# Altium schematic sheet Pallette v0.5.SchDoc
size A3
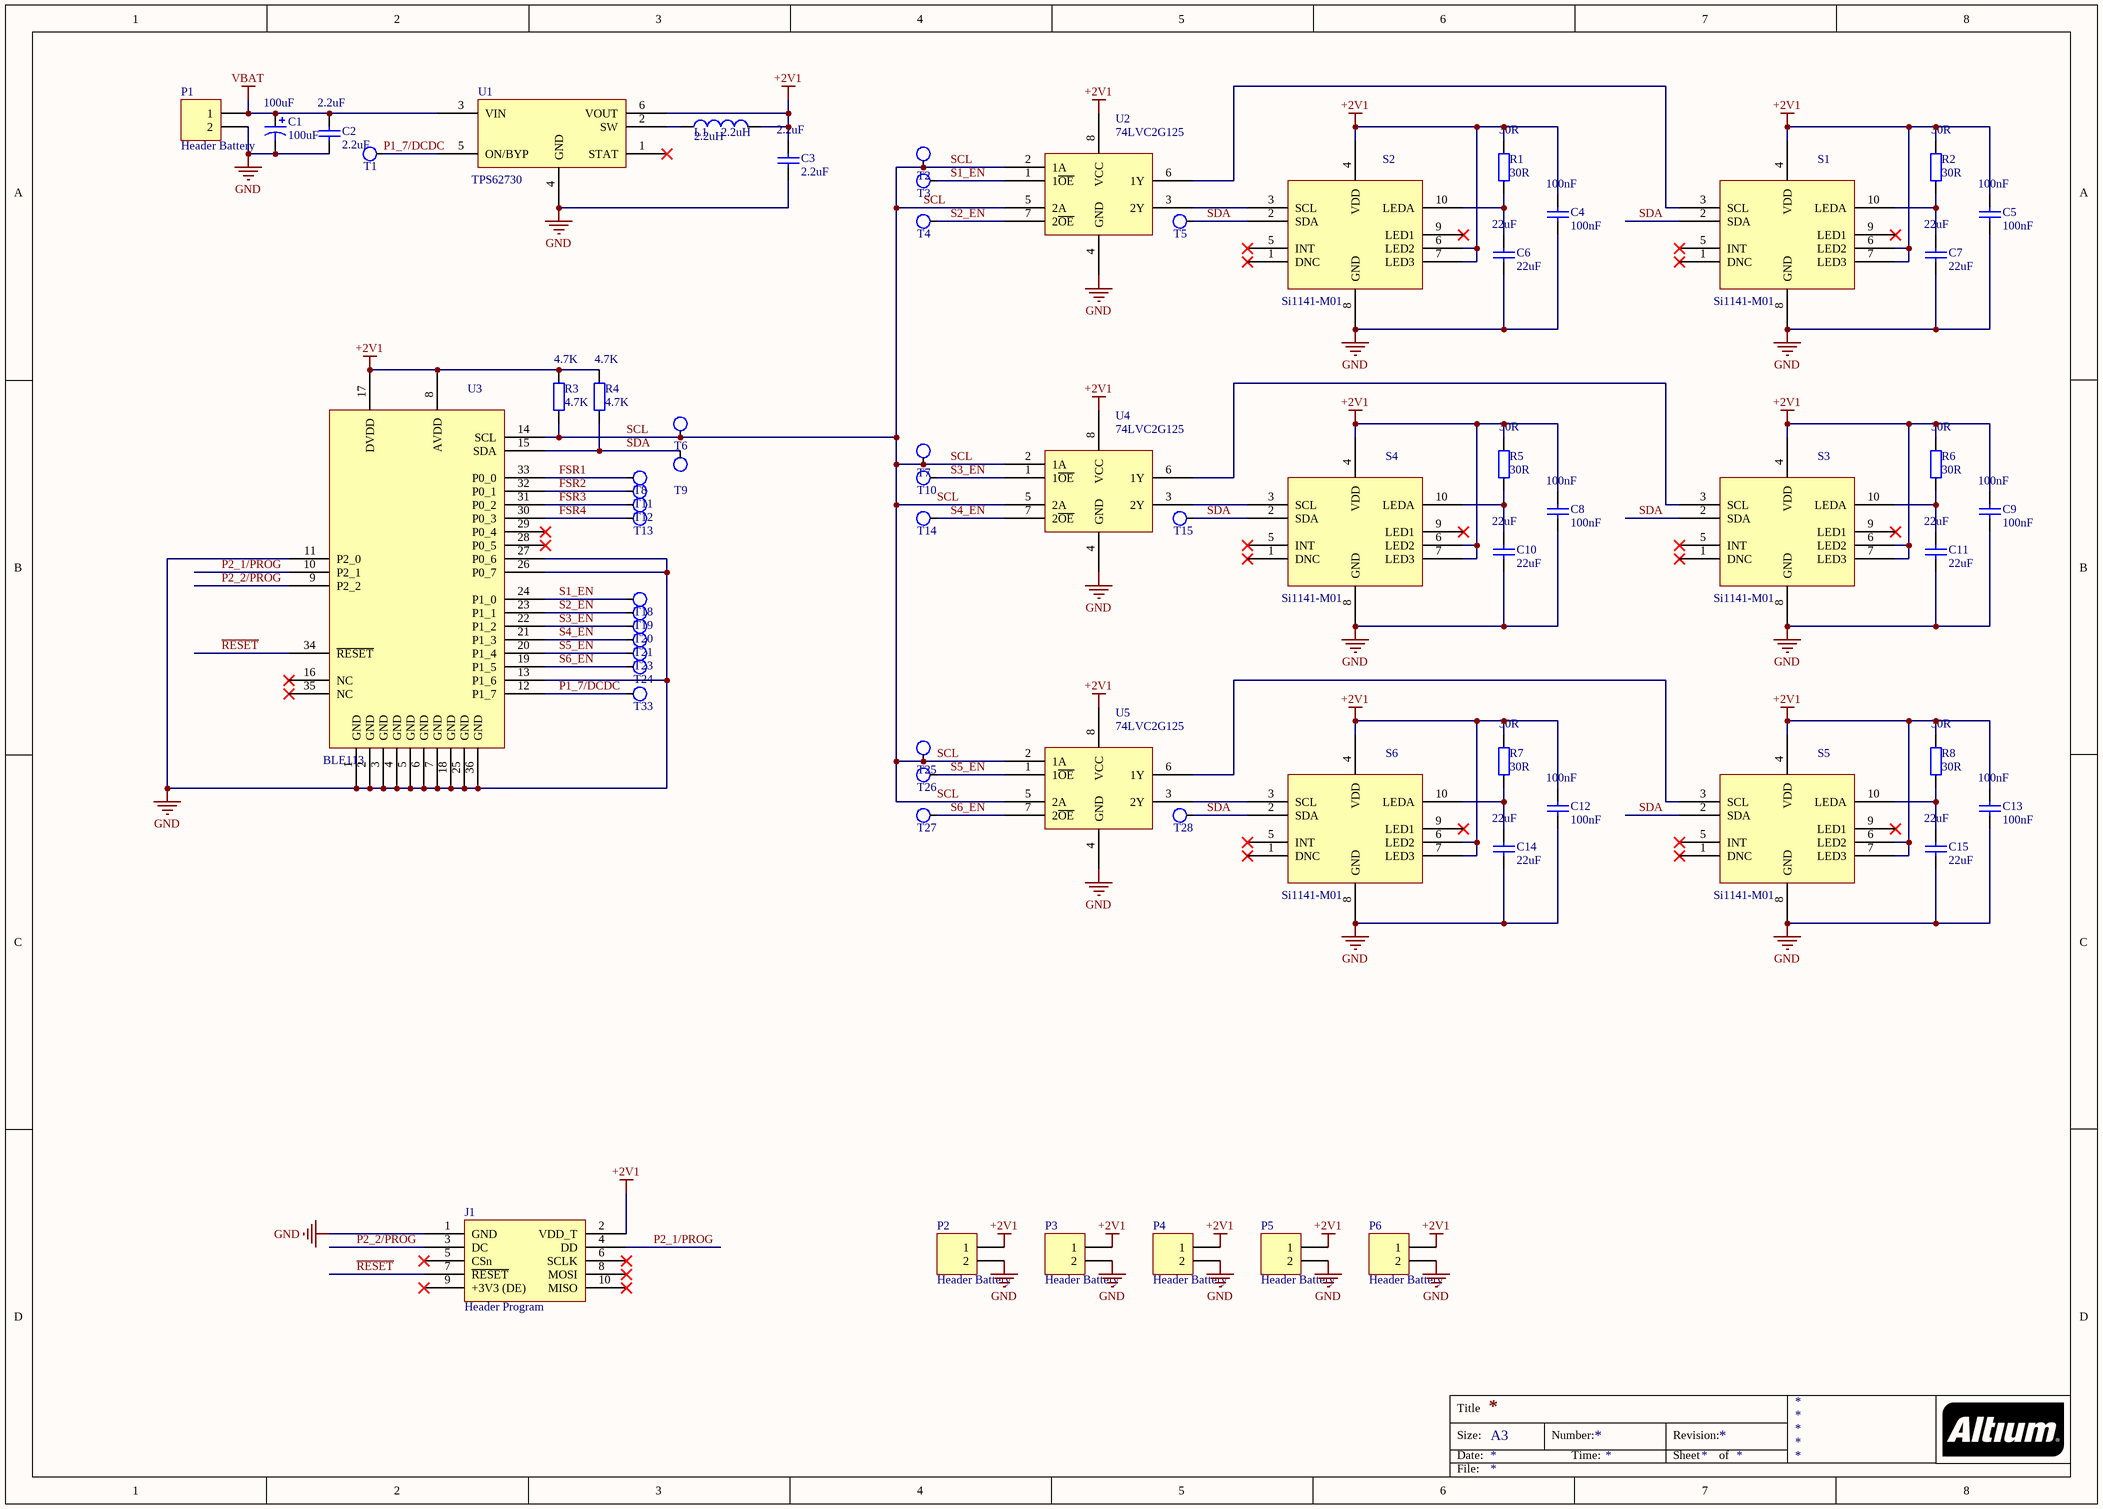
[diagram p0: Pallette v0.5.SchDoc]

## Parts
C1  100uF  [1411]
C2  2.2uF  [0402]
C3  2.2uF  [0402]
C4  100nF  [0402]
C5  100nF  [0402]
C6  22uF  [0603]
C7  22uF  [0603]
C8  100nF  [0402]
C9  100nF  [0402]
C10  22uF  [0603]
C11  22uF  [0603]
C12  100nF  [0402]
C13  100nF  [0402]
C14  22uF  [0603]
C15  22uF  [0603]
J1  Header Program  [TC2050-IDC-NL]  (no BOM)
L1  2.2uH  [0805]
P1  Header Battery  [Battery Leads]  (no BOM)
P2  Header Battery  [Battery Leads]  (no BOM)
P3  Header Battery  [Battery Leads]  (no BOM)
P4  Header Battery  [Battery Leads]  (no BOM)
P5  Header Battery  [Battery Leads]  (no BOM)
P6  Header Battery  [Battery Leads]  (no BOM)
R1  30R  [0402]
R2  30R  [0402]
R3  4.7K  [0402]
R4  4.7K  [0402]
R5  30R  [0402]
R6  30R  [0402]
R7  30R  [0402]
R8  30R  [0402]
S1  Si1141-M01  [SI1141-M01]
S2  Si1141-M01  [SI1141-M01]
S3  Si1141-M01  [SI1141-M01]
S4  Si1141-M01  [SI1141-M01]
S5  Si1141-M01  [SI1141-M01]
S6  Si1141-M01  [SI1141-M01]
T1  TP 1.2X2MM  [TP 1.2x2MM]  (value not drawn)  (no BOM)
T2  TP 1.2X2MM  [TP 1.2x2MM]  (value not drawn)  (no BOM)
T3  TP 1.2X2MM  [TP 1.2x2MM]  (value not drawn)  (no BOM)
T4  TP 1.2X2MM  [TP 1.2x2MM]  (value not drawn)  (no BOM)
T5  TP 1.2X2MM  [TP 1.2x2MM]  (value not drawn)  (no BOM)
T6  TP 1.2X2MM  [TP 1.2x2MM]  (value not drawn)  (no BOM)
T7  TP 1.2X2MM  [TP 1.2x2MM]  (value not drawn)  (no BOM)
T8  TP 1.2X2MM  [TP 1.2x2MM]  (value not drawn)  (no BOM)
T9  TP 1.2X2MM  [TP 1.2x2MM]  (value not drawn)  (no BOM)
T10  TP 1.2X2MM  [TP 1.2x2MM]  (value not drawn)  (no BOM)
T11  TP 1.2X2MM  [TP 1.2x2MM]  (value not drawn)  (no BOM)
T12  TP 1.2X2MM  [TP 1.2x2MM]  (value not drawn)  (no BOM)
T13  TP 1.2X2MM  [TP 1.2x2MM]  (value not drawn)  (no BOM)
T14  TP 1.2X2MM  [TP 1.2x2MM]  (value not drawn)  (no BOM)
T15  TP 1.2X2MM  [TP 1.2x2MM]  (value not drawn)  (no BOM)
T18  TP 1.2X2MM  [TP 1.2x2MM]  (value not drawn)  (no BOM)
T19  TP 1.2X2MM  [TP 1.2x2MM]  (value not drawn)  (no BOM)
T20  TP 1.2X2MM  [TP 1.2x2MM]  (value not drawn)  (no BOM)
T21  TP 1.2X2MM  [TP 1.2x2MM]  (value not drawn)  (no BOM)
T23  TP 1.2X2MM  [TP 1.2x2MM]  (value not drawn)  (no BOM)
T24  TP 1.2X2MM  [TP 1.2x2MM]  (value not drawn)  (no BOM)
T25  TP 1.2X2MM  [TP 1.2x2MM]  (value not drawn)  (no BOM)
T26  TP 1.2X2MM  [TP 1.2x2MM]  (value not drawn)  (no BOM)
T27  TP 1.2X2MM  [TP 1.2x2MM]  (value not drawn)  (no BOM)
T28  TP 1.2X2MM  [TP 1.2x2MM]  (value not drawn)  (no BOM)
T33  TP 1.2X2MM  [TP 1.2x2MM]  (value not drawn)  (no BOM)
U1  TPS62730  [6-UFDFN]
U2  74LVC2G125  [VSSOP8]
U3  BLE113  [BLE113-A]
U4  74LVC2G125  [VSSOP8]
U5  74LVC2G125  [VSSOP8]

## Nets
+2V1: C3.2 C4.2 C5.2 C8.2 C9.2 C12.2 C13.2 J1.2(VDD_T) L1.2 P2.1 P3.1 P4.1 P5.1 P6.1 R1.2 R2.2 R3.2 R4.2 R5.2 R6.2 R7.2 R8.2 S1.4(VDD) S1.6(LED2) S1.7(LED3) S2.4(VDD) S2.6(LED2) S2.7(LED3) S3.4(VDD) S3.6(LED2) S3.7(LED3) S4.4(VDD) S4.6(LED2) S4.7(LED3) S5.4(VDD) S5.6(LED2) S5.7(LED3) S6.4(VDD) S6.6(LED2) S6.7(LED3) U1.6(VOUT) U2.8(VCC) U3.8(AVDD) U3.17(DVDD) U4.8(VCC) U5.8(VCC)
GND: C1.2 C2.1 C3.1 C4.1 C5.1 C6.1 C7.1 C8.1 C9.1 C10.1 C11.1 C12.1 C13.1 C14.1 C15.1 J1.1(GND) P1.2 P2.2 P3.2 P4.2 P5.2 P6.2 S1.8(GND) S2.8(GND) S3.8(GND) S4.8(GND) S5.8(GND) S6.8(GND) U1.4(GND) U2.4(GND) U3.1(GND) U3.2(GND) U3.3(GND) U3.4(GND) U3.5(GND) U3.6(GND) U3.7(GND) U3.11(P2_0) U3.13(P1_6) U3.18(GND) U3.25(GND) U3.26(P0_7) U3.27(P0_6) U3.36(GND) U4.4(GND) U5.4(GND)
VBAT: C1.1 C2.2 P1.1 U1.3(VIN)
FSR1: T8.1 U3.33(P0_0)
FSR2: T11.1 U3.32(P0_1)
FSR3: T12.1 U3.31(P0_2)
FSR4: T13.1 U3.30(P0_3)
P1_7/DCDC: T1.1 T33.1 U1.5(ON/BYP) U3.12(P1_7)
P2_1/PROG: J1.4(DD) U3.10(P2_1)
P2_2/PROG: J1.3(DC) U3.9(P2_2)
~{RESET}: J1.7(~{RESET}) U3.34(~{RESET})
S1_EN: T3.1 T18.1 U2.1(1~{OE}) U3.24(P1_0)
S2_EN: T4.1 T19.1 U2.7(2~{OE}) U3.23(P1_1)
S3_EN: T10.1 T20.1 U3.22(P1_2) U4.1(1~{OE})
S4_EN: T14.1 T21.1 U3.21(P1_3) U4.7(2~{OE})
S5_EN: T23.1 T26.1 U3.20(P1_4) U5.1(1~{OE})
S6_EN: T24.1 T27.1 U3.19(P1_5) U5.7(2~{OE})
SCL: R3.1 T2.1 T6.1 T7.1 T25.1 U2.2(1A) U2.5(2A) U3.14(SCL) U4.2(1A) U4.5(2A) U5.2(1A) U5.5(2A)
SDA: R4.1 S1.2(SDA) S2.2(SDA) S3.2(SDA) S4.2(SDA) S5.2(SDA) S6.2(SDA) T5.1 T9.1 T15.1 T28.1 U3.15(SDA)
NetC6_2: C6.2 R1.1 S2.10(LEDA)
NetC7_2: C7.2 R2.1 S1.10(LEDA)
NetC10_2: C10.2 R5.1 S4.10(LEDA)
NetC11_2: C11.2 R6.1 S3.10(LEDA)
NetC14_2: C14.2 R7.1 S6.10(LEDA)
NetC15_2: C15.2 R8.1 S5.10(LEDA)
NetL1_1: L1.1 U1.2(SW)
NetS1_3: S1.3(SCL) U2.6(1Y)
NetS2_3: S2.3(SCL) U2.3(2Y)
NetS3_3: S3.3(SCL) U4.6(1Y)
NetS4_3: S4.3(SCL) U4.3(2Y)
NetS5_3: S5.3(SCL) U5.6(1Y)
NetS6_3: S6.3(SCL) U5.3(2Y)

Not connected (* = marked no-connect by the designer): J1 5(CSn)* 6(SCLK)* 8(MOSI)* 9(+3V3_(DE))* 10(MISO)*; S1 1(DNC)* 5(INT)* 9(LED1)*; S2 1(DNC)* 5(INT)* 9(LED1)*; S3 1(DNC)* 5(INT)* 9(LED1)*; S4 1(DNC)* 5(INT)* 9(LED1)*; S5 1(DNC)* 5(INT)* 9(LED1)*; S6 1(DNC)* 5(INT)* 9(LED1)*; U1 1(STAT)*; U3 16(NC)* 28(P0_5)* 29(P0_4)* 35(NC)*

## Notes on the sheet
- Title
- Size:
- Date:
- A3
- Number:
- Time:
- Revision:
- Sheet
- of
- File:

## Library data of the parts
C1 = Cap Pol 100uF: CAP TANT POLY 100UF 8V 1411; Manufacturer: Panasonic Electronic Components; Manufacturer Part Number: 8TPE100MAZB; Value: 100uF; Digi-Key Part Number: P16641CT-ND
C2 C3 = Cap 2.2uF: CAP CER 2.2UF 6.3V X5R 0402; Manufacturer Part Number: 04026D225KAT2A; Manufacturer: AVX Corporation; Value: 2.2uF; Digi-Key Part Number: 478-7885-1-ND
C4 C5 C8 C9 C12 C13 = Cap 100nF: CAP CER 0.1UF 10V X5R 0402; Manufacturer: Murata; Manufacturer Part Number: GRM155R61A104KA01D; Value: 100nF; Digi-Key Part Number: 490-1318-1-ND
C6 C7 C10 C11 C14 C15 = Cap 22uF: CAP CER 22UF 6.3V X5R 0603; Manufacturer Part Number: GRM188R60J226MEA0D; Manufacturer: Murata; Value: 22uF; Digi-Key Part Number: 490-7611-1-ND
J1 = Header Program: PADS PROGRAMMING
L1 = Ind 2.2uH: FIXED IND 2.2UH 800MA 120 MOHM; Manufacturer: TDK Corporation; Manufacturer Part Number: MLZ2012N2R2LT000; Value: 2.2uH; Digi-Key Part Number: 445-6758-1-ND
P1-P6 = Header Battery: PADS BATTERY; LatestRevisionDate: 17-Jul-2002; LatestRevisionNote: Re-released for DXP Platform.; Publisher: Altium Limited
R1 R2 R5-R8 = Res 30R: RES SMD 30 OHM 1% 1/16W 0402; Manufacturer: Yageo; Manufacturer Part Number: RC0402FR-0730RL; Value: 30R; Digi-Key Part Number: 311-30LRCT-ND
R3 R4 = Res 4.7K: RES SMD 4.7K OHM 1% 1/16W 0402; Manufacturer: Yageo; Manufacturer Part Number: RC0402FR-074K7L; Value: 4.7K; Digi-Key Part Number: 311-4.7KLRCT-ND
S1-S6 = Si1141-M01: SENSOR IR PROXIMITY AMB LT 10QFN; Manufacturer: Silicon Labs; Manufacturer Part Number: SI1141-M01-GMR; Digi-Key Part Number: 336-3260-1-ND
T1-T15 T18-T21 T23-T28 T33 = TP 1.2X2MM: TEST POINT
U1 = TPS62730: IC DCDC CONV STP-DN SYNC LP 6SON; Manufacturer: Texas Instruments; Manufacturer Part Number: TPS62730DRYT; Digi-Key Part Number: 296-28820-1-ND
U2 U4 U5 = 74LVC2G125: IC BUS BUFF DVR TRI-ST DL 8VSSOP; Manufacturer: NXP Semiconductors; Manufacturer Part Number: 74LVC2G125DC,125; Digi-Key Part Number: 568-7675-1-ND
U3 = BLE113: MODULE BT 4.0 BLE113 OTA; Manufacturer: Silicon Labs; Manufacturer Part Number: BLE113-A-M256K; Digi-Key Part Number: 1446-1035-1-ND